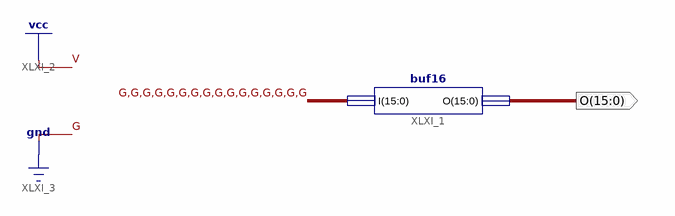
[diagram p0: schematic sheet 1]
// Xilinx ISE schematic constant16b0000.sch (spartan3adsp) as structural Verilog: 1 symbols, 1 ports
module constant16b0000 (
  output [15:0] O
);

  buf16 XLXI_1 (.I({16{1'b0}}), .O(O));
endmodule
